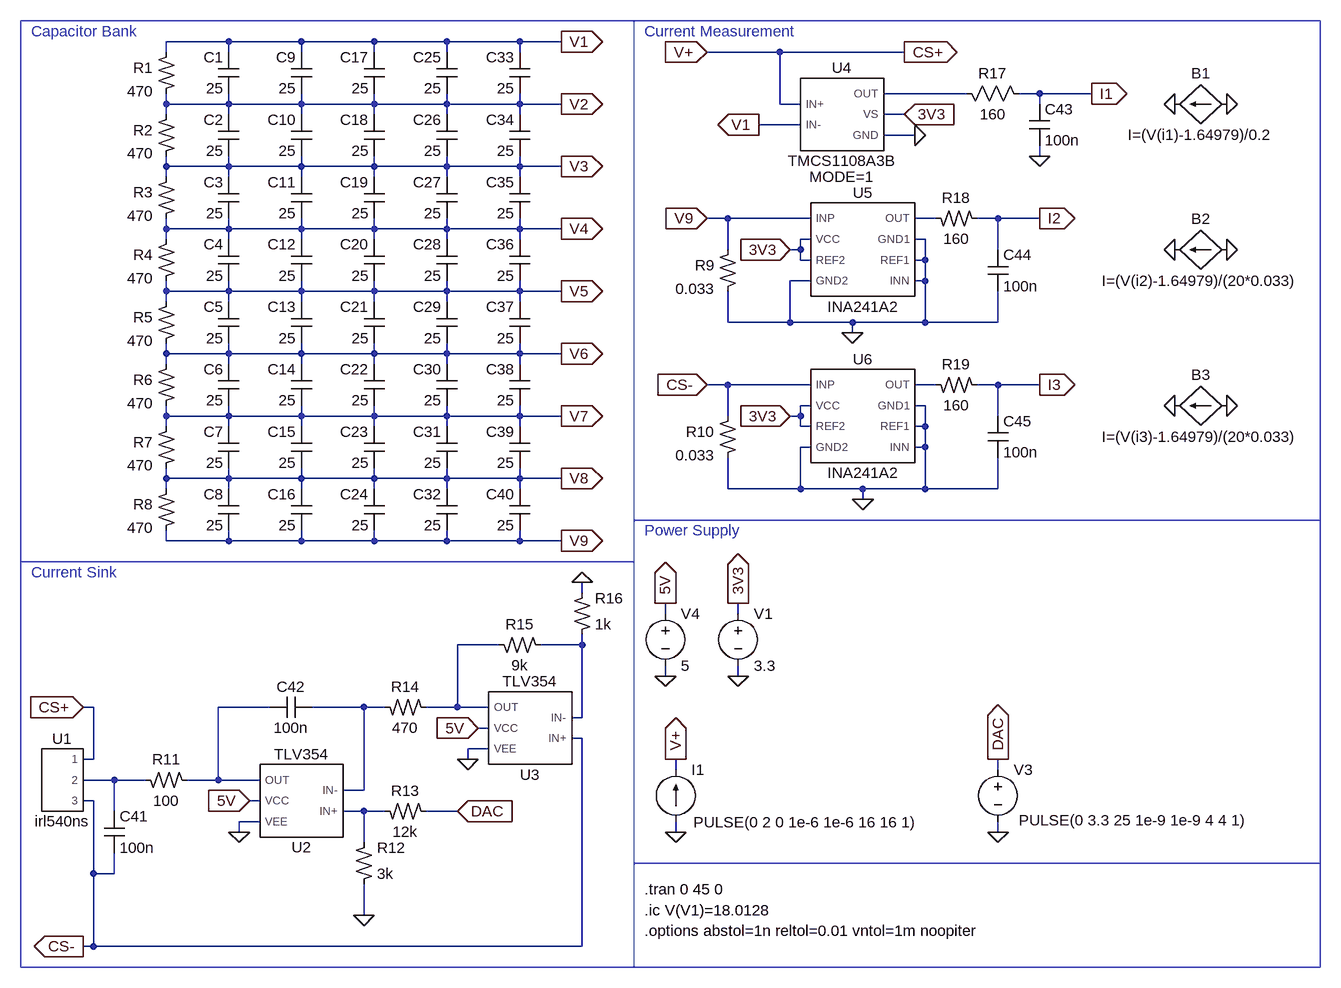
[diagram p0: schematic Capacitor_Measurement.asc]
Capacitor_Measurement.asc, the LTspice schematic file:
Version 4.1
SHEET 1 2580 1540
WIRE -384 -256 -480 -256
WIRE -272 -256 -384 -256
WIRE -160 -256 -272 -256
WIRE -48 -256 -160 -256
WIRE 64 -256 -48 -256
WIRE 128 -256 64 -256
WIRE -480 -240 -480 -256
WIRE -384 -240 -384 -256
WIRE -272 -240 -272 -256
WIRE -160 -240 -160 -256
WIRE -48 -240 -48 -256
WIRE 64 -240 64 -256
WIRE 464 -240 352 -240
WIRE 656 -240 464 -240
WIRE 752 -176 624 -176
WIRE 864 -176 832 -176
WIRE 944 -176 864 -176
WIRE -480 -160 -480 -176
WIRE -384 -160 -384 -176
WIRE -384 -160 -480 -160
WIRE -272 -160 -272 -176
WIRE -272 -160 -384 -160
WIRE -160 -160 -160 -176
WIRE -160 -160 -272 -160
WIRE -48 -160 -48 -176
WIRE -48 -160 -160 -160
WIRE 64 -160 64 -176
WIRE 64 -160 -48 -160
WIRE 128 -160 64 -160
WIRE 464 -160 464 -240
WIRE 496 -160 464 -160
WIRE 864 -160 864 -176
WIRE -480 -144 -480 -160
WIRE -384 -144 -384 -160
WIRE -272 -144 -272 -160
WIRE -160 -144 -160 -160
WIRE -48 -144 -48 -160
WIRE 64 -144 64 -160
WIRE 656 -144 624 -144
WIRE 496 -128 432 -128
WIRE 672 -112 624 -112
WIRE 864 -80 864 -96
WIRE -480 -64 -480 -80
WIRE -384 -64 -384 -80
WIRE -384 -64 -480 -64
WIRE -272 -64 -272 -80
WIRE -272 -64 -384 -64
WIRE -160 -64 -160 -80
WIRE -160 -64 -272 -64
WIRE -48 -64 -48 -80
WIRE -48 -64 -160 -64
WIRE 64 -64 64 -80
WIRE 64 -64 -48 -64
WIRE 128 -64 64 -64
WIRE -480 -48 -480 -64
WIRE -384 -48 -384 -64
WIRE -272 -48 -272 -64
WIRE -160 -48 -160 -64
WIRE -48 -48 -48 -64
WIRE 64 -48 64 -64
WIRE 384 16 352 16
WIRE 512 16 384 16
WIRE 704 16 672 16
WIRE 800 16 768 16
WIRE 864 16 800 16
WIRE -480 32 -480 16
WIRE -384 32 -384 16
WIRE -384 32 -480 32
WIRE -272 32 -272 16
WIRE -272 32 -384 32
WIRE -160 32 -160 16
WIRE -160 32 -272 32
WIRE -48 32 -48 16
WIRE -48 32 -160 32
WIRE 64 32 64 16
WIRE 64 32 -48 32
WIRE 128 32 64 32
WIRE -480 48 -480 32
WIRE -384 48 -384 32
WIRE -272 48 -272 32
WIRE -160 48 -160 32
WIRE -48 48 -48 32
WIRE 64 48 64 32
WIRE 512 48 496 48
WIRE 688 48 672 48
WIRE 384 64 384 16
WIRE 496 64 496 48
WIRE 496 64 480 64
WIRE 800 64 800 16
WIRE 496 80 496 64
WIRE 512 80 496 80
WIRE 688 80 688 48
WIRE 688 80 672 80
WIRE 512 112 480 112
WIRE 688 112 688 80
WIRE 688 112 672 112
WIRE -480 128 -480 112
WIRE -384 128 -384 112
WIRE -384 128 -480 128
WIRE -272 128 -272 112
WIRE -272 128 -384 128
WIRE -160 128 -160 112
WIRE -160 128 -272 128
WIRE -48 128 -48 112
WIRE -48 128 -160 128
WIRE 64 128 64 112
WIRE 64 128 -48 128
WIRE 128 128 64 128
WIRE -480 144 -480 128
WIRE -384 144 -384 128
WIRE -272 144 -272 128
WIRE -160 144 -160 128
WIRE -48 144 -48 128
WIRE 64 144 64 128
WIRE 384 176 384 128
WIRE 480 176 480 112
WIRE 480 176 384 176
WIRE 576 176 480 176
WIRE 688 176 688 112
WIRE 688 176 576 176
WIRE 800 176 800 128
WIRE 800 176 688 176
WIRE 576 192 576 176
WIRE -480 224 -480 208
WIRE -384 224 -384 208
WIRE -384 224 -480 224
WIRE -272 224 -272 208
WIRE -272 224 -384 224
WIRE -160 224 -160 208
WIRE -160 224 -272 224
WIRE -48 224 -48 208
WIRE -48 224 -160 224
WIRE 64 224 64 208
WIRE 64 224 -48 224
WIRE 128 224 64 224
WIRE -480 240 -480 224
WIRE -384 240 -384 224
WIRE -272 240 -272 224
WIRE -160 240 -160 224
WIRE -48 240 -48 224
WIRE 64 240 64 224
WIRE 384 272 352 272
WIRE 512 272 384 272
WIRE 704 272 672 272
WIRE 800 272 768 272
WIRE 864 272 800 272
WIRE 512 304 496 304
WIRE 688 304 672 304
WIRE -480 320 -480 304
WIRE -384 320 -384 304
WIRE -384 320 -480 320
WIRE -272 320 -272 304
WIRE -272 320 -384 320
WIRE -160 320 -160 304
WIRE -160 320 -272 320
WIRE -48 320 -48 304
WIRE -48 320 -160 320
WIRE 64 320 64 304
WIRE 64 320 -48 320
WIRE 128 320 64 320
WIRE 384 320 384 272
WIRE 496 320 496 304
WIRE 496 320 480 320
WIRE 800 320 800 272
WIRE -480 336 -480 320
WIRE -384 336 -384 320
WIRE -272 336 -272 320
WIRE -160 336 -160 320
WIRE -48 336 -48 320
WIRE 64 336 64 320
WIRE 496 336 496 320
WIRE 512 336 496 336
WIRE 688 336 688 304
WIRE 688 336 672 336
WIRE 512 368 496 368
WIRE 688 368 688 336
WIRE 688 368 672 368
WIRE -480 416 -480 400
WIRE -384 416 -384 400
WIRE -384 416 -480 416
WIRE -272 416 -272 400
WIRE -272 416 -384 416
WIRE -160 416 -160 400
WIRE -160 416 -272 416
WIRE -48 416 -48 400
WIRE -48 416 -160 416
WIRE 64 416 64 400
WIRE 64 416 -48 416
WIRE 128 416 64 416
WIRE -480 432 -480 416
WIRE -384 432 -384 416
WIRE -272 432 -272 416
WIRE -160 432 -160 416
WIRE -48 432 -48 416
WIRE 64 432 64 416
WIRE 384 432 384 384
WIRE 496 432 496 368
WIRE 496 432 384 432
WIRE 592 432 496 432
WIRE 688 432 688 368
WIRE 688 432 592 432
WIRE 800 432 800 384
WIRE 800 432 688 432
WIRE 592 448 592 432
WIRE -480 512 -480 496
WIRE -384 512 -384 496
WIRE -384 512 -480 512
WIRE -272 512 -272 496
WIRE -272 512 -384 512
WIRE -160 512 -160 496
WIRE -160 512 -272 512
WIRE -48 512 -48 496
WIRE -48 512 -160 512
WIRE 64 512 64 496
WIRE 64 512 -48 512
WIRE 128 512 64 512
WIRE 160 592 160 576
WIRE 288 624 288 608
WIRE 400 624 400 608
WIRE 32 672 -32 672
WIRE 160 672 160 656
WIRE 160 672 96 672
WIRE 288 720 288 704
WIRE 400 720 400 704
WIRE -592 768 -608 768
WIRE -320 768 -400 768
WIRE -176 768 -256 768
WIRE -144 768 -176 768
WIRE -32 768 -32 672
WIRE -32 768 -80 768
WIRE 16 768 -32 768
WIRE 160 784 160 672
WIRE 160 784 144 784
WIRE 16 800 0 800
WIRE 160 816 144 816
WIRE 16 832 -16 832
WIRE -592 848 -592 768
WIRE -592 848 -608 848
WIRE -16 848 -16 832
WIRE 304 864 304 848
WIRE 800 864 800 848
WIRE -560 880 -608 880
WIRE -512 880 -560 880
WIRE -400 880 -400 768
WIRE -400 880 -448 880
WIRE -336 880 -400 880
WIRE -176 896 -176 768
WIRE -176 896 -208 896
WIRE -592 912 -608 912
WIRE -336 912 -352 912
WIRE -560 928 -560 880
WIRE -176 928 -208 928
WIRE -144 928 -176 928
WIRE -32 928 -80 928
WIRE -336 944 -368 944
WIRE -368 960 -368 944
WIRE 304 960 304 944
WIRE 800 960 800 944
WIRE -176 976 -176 928
WIRE -592 1024 -592 912
WIRE -560 1024 -560 992
WIRE -560 1024 -592 1024
WIRE -176 1088 -176 1040
WIRE -592 1136 -592 1024
WIRE -592 1136 -608 1136
WIRE 160 1136 160 816
WIRE 160 1136 -592 1136
FLAG 400 720 0
FLAG 400 608 3V3
IOPIN 400 608 Out
FLAG 800 960 0
FLAG 800 848 DAC
IOPIN 800 848 Out
FLAG -352 912 5V
IOPIN -352 912 In
FLAG 288 720 0
FLAG 288 608 5V
IOPIN 288 608 Out
FLAG 160 576 0
FLAG -32 928 DAC
IOPIN -32 928 In
FLAG 576 192 0
FLAG 128 -256 V1
IOPIN 128 -256 Out
FLAG 128 -160 V2
IOPIN 128 -160 Out
FLAG 128 -64 V3
IOPIN 128 -64 Out
FLAG 128 32 V4
IOPIN 128 32 Out
FLAG 128 128 V5
IOPIN 128 128 Out
FLAG 128 224 V6
IOPIN 128 224 Out
FLAG 128 320 V7
IOPIN 128 320 Out
FLAG 128 416 V8
IOPIN 128 416 Out
FLAG 128 512 V9
IOPIN 128 512 Out
FLAG -176 1088 0
FLAG 944 -176 I1
IOPIN 944 -176 Out
FLAG 864 16 I2
IOPIN 864 16 Out
FLAG 864 272 I3
IOPIN 864 272 Out
FLAG 864 -80 0
FLAG 656 -240 CS+
IOPIN 656 -240 Out
FLAG -608 768 CS+
IOPIN -608 768 In
FLAG -608 1136 CS-
IOPIN -608 1136 Out
FLAG -368 960 0
FLAG -16 848 0
FLAG 304 960 0
FLAG 304 848 V+
IOPIN 304 848 Out
FLAG 352 -240 V+
IOPIN 352 -240 In
FLAG 480 64 3V3
IOPIN 480 64 In
FLAG 480 320 3V3
IOPIN 480 320 In
FLAG 0 800 5V
IOPIN 0 800 In
FLAG 656 -144 3V3
IOPIN 656 -144 In
FLAG 1152 -160 0
FLAG 1072 -160 0
FLAG 1152 64 0
FLAG 1072 64 0
FLAG 1152 304 0
FLAG 1072 304 0
FLAG 352 16 V9
IOPIN 352 16 In
FLAG 432 -128 V1
IOPIN 432 -128 Out
FLAG 352 272 CS-
IOPIN 352 272 In
FLAG 592 448 0
FLAG 672 -112 0
SYMBOL voltage 400 608 R0
SYMATTR InstName V1
SYMATTR Value 3.3
SYMBOL voltage 800 848 R0
WINDOW 123 0 0 Left 0
WINDOW 39 0 0 Left 0
WINDOW 3 32 94 Left 2
SYMATTR Value PULSE(0 3.3 25 1e-9 1e-9 4 4 1)
SYMATTR InstName V3
SYMBOL voltage 288 608 R0
WINDOW 123 0 0 Left 0
WINDOW 39 0 0 Left 0
SYMATTR InstName V4
SYMATTR Value 5
SYMBOL cap -368 -48 M0
SYMATTR InstName C3
SYMATTR Value 25
SYMATTR SpiceLine Rser=0.034
SYMBOL cap -368 48 M0
SYMATTR InstName C4
SYMATTR Value 25
SYMATTR SpiceLine Rser=0.034
SYMBOL cap -368 144 M0
SYMATTR InstName C5
SYMATTR Value 25
SYMATTR SpiceLine Rser=0.034
SYMBOL cap -368 240 M0
SYMATTR InstName C6
SYMATTR Value 25
SYMATTR SpiceLine Rser=0.034
SYMBOL cap -368 336 M0
SYMATTR InstName C7
SYMATTR Value 25
SYMATTR SpiceLine Rser=0.034
SYMBOL cap -368 432 M0
SYMATTR InstName C8
SYMATTR Value 25
SYMATTR SpiceLine Rser=0.034
SYMBOL cap -256 -240 M0
SYMATTR InstName C9
SYMATTR Value 25
SYMATTR SpiceLine Rser=0.034
SYMBOL cap -256 -144 M0
SYMATTR InstName C10
SYMATTR Value 25
SYMATTR SpiceLine Rser=0.034
SYMBOL cap -256 -48 M0
SYMATTR InstName C11
SYMATTR Value 25
SYMATTR SpiceLine Rser=0.034
SYMBOL cap -256 48 M0
SYMATTR InstName C12
SYMATTR Value 25
SYMATTR SpiceLine Rser=0.034
SYMBOL cap -256 144 M0
SYMATTR InstName C13
SYMATTR Value 25
SYMATTR SpiceLine Rser=0.034
SYMBOL cap -256 240 M0
SYMATTR InstName C14
SYMATTR Value 25
SYMATTR SpiceLine Rser=0.034
SYMBOL cap -256 336 M0
SYMATTR InstName C15
SYMATTR Value 25
SYMATTR SpiceLine Rser=0.034
SYMBOL cap -256 432 M0
SYMATTR InstName C16
SYMATTR Value 25
SYMATTR SpiceLine Rser=0.034
SYMBOL cap -144 -240 M0
SYMATTR InstName C17
SYMATTR Value 25
SYMATTR SpiceLine Rser=0.034
SYMBOL cap -144 -144 M0
SYMATTR InstName C18
SYMATTR Value 25
SYMATTR SpiceLine Rser=0.034
SYMBOL cap -144 -48 M0
SYMATTR InstName C19
SYMATTR Value 25
SYMATTR SpiceLine Rser=0.034
SYMBOL cap -144 48 M0
SYMATTR InstName C20
SYMATTR Value 25
SYMATTR SpiceLine Rser=0.034
SYMBOL cap -144 144 M0
SYMATTR InstName C21
SYMATTR Value 25
SYMATTR SpiceLine Rser=0.034
SYMBOL cap -144 240 M0
SYMATTR InstName C22
SYMATTR Value 25
SYMATTR SpiceLine Rser=0.034
SYMBOL cap -144 336 M0
SYMATTR InstName C23
SYMATTR Value 25
SYMATTR SpiceLine Rser=0.034
SYMBOL cap -144 432 M0
SYMATTR InstName C24
SYMATTR Value 25
SYMATTR SpiceLine Rser=0.034
SYMBOL cap -32 -240 M0
SYMATTR InstName C25
SYMATTR Value 25
SYMATTR SpiceLine Rser=0.034
SYMBOL cap -32 -144 M0
SYMATTR InstName C26
SYMATTR Value 25
SYMATTR SpiceLine Rser=0.034
SYMBOL cap -32 -48 M0
SYMATTR InstName C27
SYMATTR Value 25
SYMATTR SpiceLine Rser=0.034
SYMBOL cap -32 48 M0
SYMATTR InstName C28
SYMATTR Value 25
SYMATTR SpiceLine Rser=0.034
SYMBOL cap -32 144 M0
SYMATTR InstName C29
SYMATTR Value 25
SYMATTR SpiceLine Rser=0.034
SYMBOL cap -32 240 M0
SYMATTR InstName C30
SYMATTR Value 25
SYMATTR SpiceLine Rser=0.034
SYMBOL cap -32 336 M0
SYMATTR InstName C31
SYMATTR Value 25
SYMATTR SpiceLine Rser=0.034
SYMBOL cap -32 432 M0
SYMATTR InstName C32
SYMATTR Value 25
SYMATTR SpiceLine Rser=0.034
SYMBOL cap -368 -240 M0
SYMATTR InstName C1
SYMATTR Value 25
SYMATTR SpiceLine Rser=0.034
SYMBOL cap -368 -144 M0
SYMATTR InstName C2
SYMATTR Value 25
SYMATTR SpiceLine Rser=0.034
SYMBOL res 848 -160 M270
WINDOW 0 32 56 VTop 2
WINDOW 3 0 56 VBottom 2
SYMATTR InstName R17
SYMATTR Value 160
SYMBOL current 304 944 M180
WINDOW 0 24 80 Left 2
WINDOW 3 27 -1 Left 2
WINDOW 123 0 0 Left 0
WINDOW 39 0 0 Left 0
SYMATTR InstName I1
SYMATTR Value PULSE(0 2 0 1e-6 1e-6 16 16 1)
SYMBOL res2 -464 -240 M0
SYMATTR InstName R1
SYMATTR Value 470
SYMATTR SpiceLine tol=1
SYMBOL res2 -464 -144 M0
SYMATTR InstName R2
SYMATTR Value 470
SYMATTR SpiceLine tol=1
SYMBOL res2 -464 -48 M0
SYMATTR InstName R3
SYMATTR Value 470
SYMATTR SpiceLine tol=1
SYMBOL res2 -464 48 M0
SYMATTR InstName R4
SYMATTR Value 470
SYMATTR SpiceLine tol=1
SYMBOL res2 -464 144 M0
SYMATTR InstName R5
SYMATTR Value 470
SYMATTR SpiceLine tol=1
SYMBOL res2 -464 240 M0
SYMATTR InstName R6
SYMATTR Value 470
SYMATTR SpiceLine tol=1
SYMBOL res2 -464 336 M0
SYMATTR InstName R7
SYMATTR Value 470
SYMATTR SpiceLine tol=1
SYMBOL res2 -464 432 M0
SYMATTR InstName R8
SYMATTR Value 470
SYMATTR SpiceLine tol=1
SYMBOL res2 400 64 M0
SYMATTR InstName R9
SYMATTR Value 0.033
SYMATTR SpiceLine tol=1
SYMBOL res2 400 320 M0
SYMATTR InstName R10
SYMATTR Value 0.033
SYMATTR SpiceLine tol=1
SYMBOL res2 -448 896 M270
WINDOW 0 32 32 VTop 2
WINDOW 3 0 32 VBottom 2
SYMATTR InstName R11
SYMATTR Value 100
SYMATTR SpiceLine tol=1
SYMBOL res2 -192 1040 M180
WINDOW 0 36 56 Left 2
WINDOW 3 36 16 Left 2
SYMATTR InstName R12
SYMATTR Value 3k
SYMATTR SpiceLine tol=1
SYMBOL res2 -80 944 M270
WINDOW 0 32 32 VTop 2
WINDOW 3 0 32 VBottom 2
SYMATTR InstName R13
SYMATTR Value 12k
SYMATTR SpiceLine tol=1
SYMBOL res2 -80 784 M270
WINDOW 0 32 32 VTop 2
WINDOW 3 0 32 VBottom 2
SYMATTR InstName R14
SYMATTR Value 470
SYMATTR SpiceLine tol=1
SYMBOL res2 96 688 M270
WINDOW 0 32 32 VTop 2
WINDOW 3 0 32 VBottom 2
SYMATTR InstName R15
SYMATTR Value 9k
SYMATTR SpiceLine tol=1
SYMBOL res2 144 656 M180
WINDOW 0 36 56 Left 2
WINDOW 3 36 16 Left 2
SYMATTR InstName R16
SYMATTR Value 1k
SYMATTR SpiceLine tol=1
SYMBOL INA241A2 592 320 R0
SYMATTR InstName U6
SYMBOL INA241A2 592 64 R0
SYMATTR InstName U5
SYMBOL bi 1152 -160 R90
WINDOW 0 -32 40 VBottom 2
WINDOW 3 32 40 VTop 2
SYMATTR InstName B1
SYMATTR Value I=(V(i1)-1.64979)/0.2
SYMBOL bi 1152 64 R90
WINDOW 0 -32 40 VBottom 2
WINDOW 3 32 40 VTop 2
SYMATTR InstName B2
SYMATTR Value I=(V(i2)-1.64979)/(20*0.033)
SYMBOL bi 1152 304 R90
WINDOW 0 -32 40 VBottom 2
WINDOW 3 32 40 VTop 2
SYMATTR InstName B3
SYMATTR Value I=(V(i3)-1.64979)/(20*0.033)
SYMBOL res2 768 32 M270
WINDOW 0 32 32 VTop 2
WINDOW 3 0 32 VBottom 2
SYMATTR InstName R18
SYMATTR Value 160
SYMATTR SpiceLine tol=1
SYMBOL res2 768 288 M270
WINDOW 0 32 32 VTop 2
WINDOW 3 0 32 VBottom 2
SYMATTR InstName R19
SYMATTR Value 160
SYMATTR SpiceLine tol=1
SYMBOL cap 80 -240 M0
SYMATTR InstName C33
SYMATTR Value 25
SYMATTR SpiceLine Rser=0.034
SYMBOL cap 80 -144 M0
SYMATTR InstName C34
SYMATTR Value 25
SYMATTR SpiceLine Rser=0.034
SYMBOL cap 80 -48 M0
SYMATTR InstName C35
SYMATTR Value 25
SYMATTR SpiceLine Rser=0.034
SYMBOL cap 80 48 M0
SYMATTR InstName C36
SYMATTR Value 25
SYMATTR SpiceLine Rser=0.034
SYMBOL cap 80 144 M0
SYMATTR InstName C37
SYMATTR Value 25
SYMATTR SpiceLine Rser=0.034
SYMBOL cap 80 240 M0
SYMATTR InstName C38
SYMATTR Value 25
SYMATTR SpiceLine Rser=0.034
SYMBOL cap 80 336 M0
SYMATTR InstName C39
SYMATTR Value 25
SYMATTR SpiceLine Rser=0.034
SYMBOL cap 80 432 M0
SYMATTR InstName C40
SYMATTR Value 25
SYMATTR SpiceLine Rser=0.034
SYMBOL cap -576 928 R0
SYMATTR InstName C41
SYMATTR Value 100n
SYMBOL cap -256 752 R90
WINDOW 0 0 32 VBottom 2
WINDOW 3 32 32 VTop 2
SYMATTR InstName C42
SYMATTR Value 100n
SYMBOL cap 848 -160 R0
SYMATTR InstName C43
SYMATTR Value 100n
SYMBOL cap 784 64 R0
SYMATTR InstName C44
SYMATTR Value 100n
SYMBOL cap 784 320 R0
SYMATTR InstName C45
SYMATTR Value 100n
SYMBOL irl540ns -640 880 R0
SYMATTR InstName U1
SYMBOL TLV354 -272 912 R180
SYMATTR InstName U2
SYMBOL TLV354 80 800 R180
SYMATTR InstName U3
SYMBOL TMCS1108A3B 560 -144 R0
SYMATTR InstName U4
TEXT 256 1048 Left 2 !.tran 0 45 0
TEXT 256 1080 Left 2 !.ic V(V1)=18.0128
TEXT 256 1112 Left 2 !.options abstol=1n reltol=0.01 vntol=1m noopiter
TEXT -688 560 Left 2 ;Current Sink
TEXT 256 496 Left 2 ;Power Supply
TEXT 256 -272 Left 2 ;Current Measurement
TEXT -688 -272 Left 2 ;Capacitor Bank
RECTANGLE Normal 1296 1168 240 1008
RECTANGLE Normal -704 544 240 1168
RECTANGLE Normal -704 -288 240 544
RECTANGLE Normal 1296 480 240 -288
RECTANGLE Normal 1296 1008 240 480

The netlist it stands for:
* Capacitor_Measurement.asc
V1 3V3 0 3.3
V3 DAC 0 PULSE(0 3.3 25 1e-9 1e-9 4 4 1)
V4 5V 0 5
C3 V3 V4 25 Rser=0.034
C4 V4 V5 25 Rser=0.034
C5 V5 V6 25 Rser=0.034
C6 V6 V7 25 Rser=0.034
C7 V7 V8 25 Rser=0.034
C8 V8 V9 25 Rser=0.034
C9 V1 V2 25 Rser=0.034
C10 V2 V3 25 Rser=0.034
C11 V3 V4 25 Rser=0.034
C12 V4 V5 25 Rser=0.034
C13 V5 V6 25 Rser=0.034
C14 V6 V7 25 Rser=0.034
C15 V7 V8 25 Rser=0.034
C16 V8 V9 25 Rser=0.034
C17 V1 V2 25 Rser=0.034
C18 V2 V3 25 Rser=0.034
C19 V3 V4 25 Rser=0.034
C20 V4 V5 25 Rser=0.034
C21 V5 V6 25 Rser=0.034
C22 V6 V7 25 Rser=0.034
C23 V7 V8 25 Rser=0.034
C24 V8 V9 25 Rser=0.034
C25 V1 V2 25 Rser=0.034
C26 V2 V3 25 Rser=0.034
C27 V3 V4 25 Rser=0.034
C28 V4 V5 25 Rser=0.034
C29 V5 V6 25 Rser=0.034
C30 V6 V7 25 Rser=0.034
C31 V7 V8 25 Rser=0.034
C32 V8 V9 25 Rser=0.034
C1 V1 V2 25 Rser=0.034
C2 V2 V3 25 Rser=0.034
R17 I1 N001 160
I1 0 V+ PULSE(0 2 0 1e-6 1e-6 16 16 1)
R1 V1 V2 470 tol=1
R2 V2 V3 470 tol=1
R3 V3 V4 470 tol=1
R4 V4 V5 470 tol=1
R5 V5 V6 470 tol=1
R6 V6 V7 470 tol=1
R7 V7 V8 470 tol=1
R8 V8 V9 470 tol=1
R9 V9 0 0.033 tol=1
R10 CS- 0 0.033 tol=1
R11 N006 N008 100 tol=1
R12 0 N009 3k tol=1
R13 DAC N009 12k tol=1
R14 N004 N007 470 tol=1
R15 N005 N004 9k tol=1
R16 N005 0 1k tol=1
X§U6 0 0 3V3 0 N003 3V3 0 CS- INA241A2  ; pins INN GND1 REF2 GND2 OUT VCC REF1 INP
X§U5 0 0 3V3 0 N002 3V3 0 V9 INA241A2  ; pins INN GND1 REF2 GND2 OUT VCC REF1 INP
B1 0 0 I=(V(i1)-1.64979)/0.2
B2 0 0 I=(V(i2)-1.64979)/(20*0.033)
B3 0 0 I=(V(i3)-1.64979)/(20*0.033)
R18 I2 N002 160 tol=1
R19 I3 N003 160 tol=1
C33 V1 V2 25 Rser=0.034
C34 V2 V3 25 Rser=0.034
C35 V3 V4 25 Rser=0.034
C36 V4 V5 25 Rser=0.034
C37 V5 V6 25 Rser=0.034
C38 V6 V7 25 Rser=0.034
C39 V7 V8 25 Rser=0.034
C40 V8 V9 25 Rser=0.034
C41 N008 CS- 100n
C42 N007 N006 100n
C43 I1 0 100n
C44 I2 0 100n
C45 I3 0 100n
X§U1 V+ N008 CS- irl540ns  ; pins 1 2 3
X§U2 N009 N007 5V 0 N006 TLV354  ; pins IN+ IN- VCC VEE OUT
X§U3 CS- N005 5V 0 N004 TLV354  ; pins IN+ IN- VCC VEE OUT
X§U4 V+ V1 3V3 0 N001 TMCS1108A3B MODE=1  ; pins IN+ IN- VS GND OUT
.tran 0 45 0
.ic V(V1)=18.0128
.options abstol=1n reltol=0.01 vntol=1m noopiter
* Current Sink
* Power Supply
* Current Measurement
* Capacitor Bank
.lib lib\241.lib
.lib lib\irl540ns.spi
.lib lib\TLV354.LIB
.lib lib\TMCS1108A3B.lib
.backanno
.end